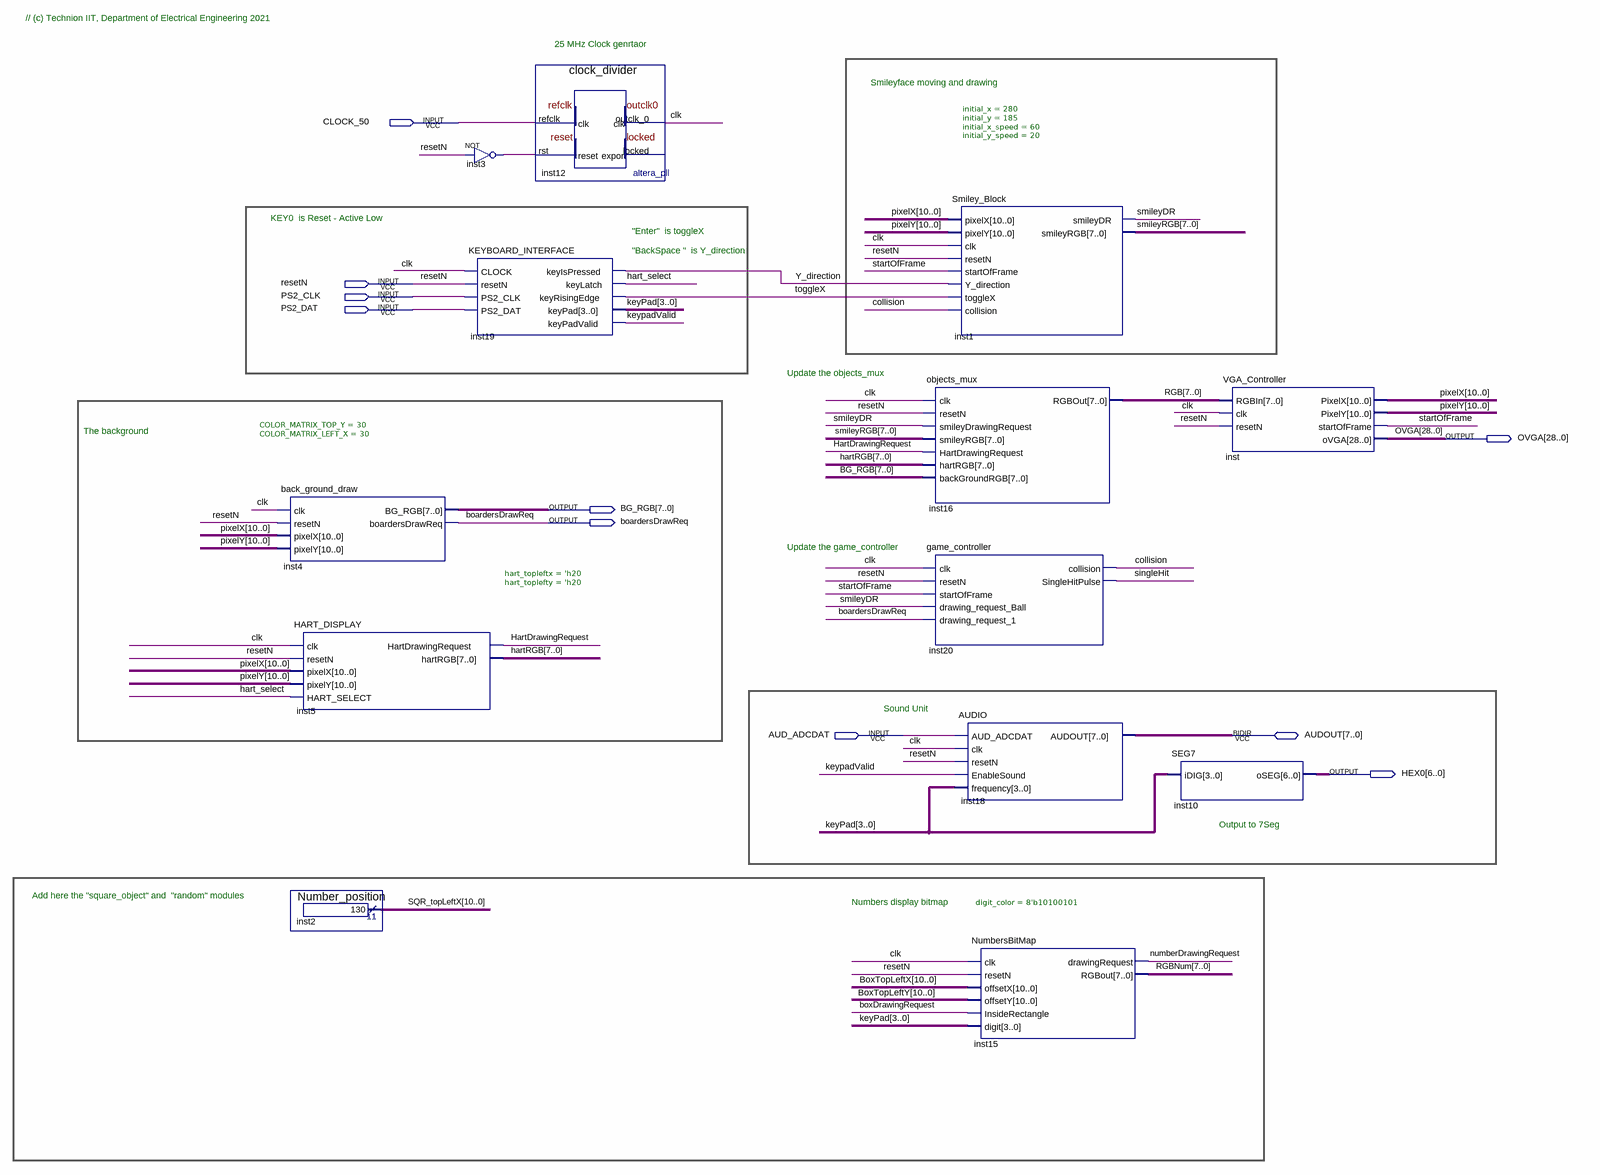
[diagram p0: schematic sheet]
// Quartus schematic TOP_VGA_DEMO_KBD_ORG.bdf as structural Verilog: 13 symbols, 10 pins
module TOP_VGA_DEMO_KBD_ORG (
  input  CLOCK_50,
  input  resetN,
  input  PS2_CLK,
  input  PS2_DAT,
  input  AUD_ADCDAT,
  inout  [7:0] AUDOUT,
  output [28:0] OVGA,
  output [7:0] BG_RGB,
  output boardersDrawReq,
  output [6:0] HEX0
);

  wire boxDrawingRequest, clk, collision, hart_select, HartDrawingRequest, inst3_out, keypadValid,
       numberDrawingRequest, singleHit, smileyDR, startOfFrame, toggleX, Y_direction;
  wire [3:0] keyPad;
  wire [7:0] hartRGB, RGB, RGBNum, smileyRGB;
  wire [10:0] BoxTopLeftX, BoxTopLeftY, pixelX, pixelY, SQR_topLeftX;

  back_ground_draw #(.COLOR_MATRIX_TOP_Y(30), .COLOR_MATRIX_LEFT_X(30)) inst4 (
    .clk(clk), .resetN(resetN), .pixelX(pixelX), .pixelY(pixelY), .BG_RGB(BG_RGB),
    .boardersDrawReq(boardersDrawReq));
  HART_DISPLAY #(.hart_topleftx('h20), .hart_toplefty('h20)) inst5 (
    .clk(clk), .resetN(resetN), .pixelX(pixelX), .pixelY(pixelY), .HART_SELECT(hart_select),
    .HartDrawingRequest(HartDrawingRequest), .hartRGB(hartRGB));
  Number_position inst2 (.result(SQR_topLeftX));
  not inst3 (inst3_out, resetN);
  KEYBOARD_INTERFACE inst19 (
    .CLOCK(clk), .resetN(resetN), .PS2_CLK(PS2_CLK), .PS2_DAT(PS2_DAT), .keyIsPressed(Y_direction),
    .keyLatch(hart_select), .keyRisingEdge(toggleX), .keyPad(keyPad), .keyPadValid(keypadValid));
  clock_divider inst12 (.refclk(CLOCK_50), .rst(inst3_out), .outclk_0(clk));  // open: locked
  objects_mux inst16 (
    .clk(clk), .resetN(resetN), .smileyDrawingRequest(smileyDR), .smileyRGB(smileyRGB),
    .HartDrawingRequest(HartDrawingRequest), .hartRGB(hartRGB), .backGroundRGB(BG_RGB), .RGBOut(RGB));
  game_controller inst20 (
    .clk(clk), .resetN(resetN), .startOfFrame(startOfFrame), .drawing_request_Ball(smileyDR),
    .drawing_request_1(boardersDrawReq), .collision(collision), .SingleHitPulse(singleHit));
  Smiley_Block #(.initial_x(280), .initial_y(185), .initial_x_speed(60), .initial_y_speed(20)) inst1 (
    .pixelX(pixelX), .pixelY(pixelY), .clk(clk), .resetN(resetN), .startOfFrame(startOfFrame),
    .Y_direction(Y_direction), .toggleX(toggleX), .collision(collision), .smileyDR(smileyDR),
    .smileyRGB(smileyRGB));
  AUDIO inst18 (
    .AUD_ADCDAT(AUD_ADCDAT), .clk(clk), .resetN(resetN), .EnableSound(keypadValid), .frequency(keyPad),
    .AUDOUT(AUDOUT));
  NumbersBitMap #(.digit_color(8'b10100101)) inst15 (
    .clk(clk), .resetN(resetN), .offsetX(BoxTopLeftX), .offsetY(BoxTopLeftY),
    .InsideRectangle(boxDrawingRequest), .digit(keyPad), .drawingRequest(numberDrawingRequest),
    .RGBout(RGBNum));
  SEG7 inst10 (.iDIG(keyPad), .oSEG(HEX0));
  VGA_Controller inst (
    .RGBIn(RGB), .clk(clk), .resetN(resetN), .PixelX(pixelX), .PixelY(pixelY), .startOfFrame(startOfFrame),
    .oVGA(OVGA));

  // Notes on the sheet:
  //   // (c) Technion IIT, Department of Electrical Engineering 2021
  //   25 MHz Clock genrtaor
  //   Smileyface moving and drawing
  //   KEY0  is Reset - Active Low
  //   "Enter"  is toggleX
  //   "BackSpace "  is Y_direction
  //   Update the objects_mux
  //   The background
  //   Update the game_controller
  //   Sound Unit
  //   Output to 7Seg
  //   Add here the "square_object" and  "random" modules
  //   Numbers display bitmap
endmodule
